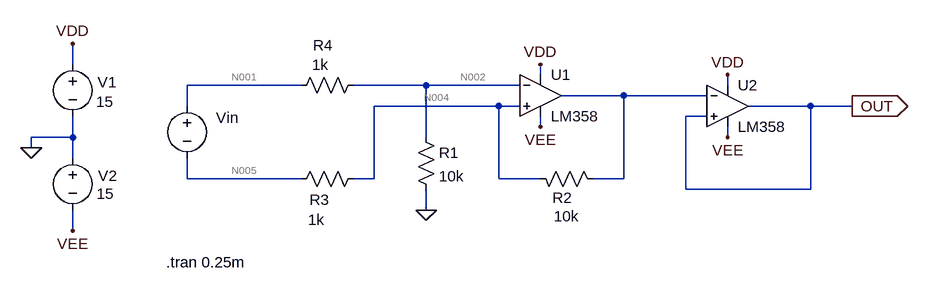
[diagram p0: schematic v1.0.asc]
* v1.0.asc
V1 VDD 0 15
Vin N001 N005 SINE(0V 1V 10KH)
R2 N003 N004 10k
V2 0 VEE 15
* U1: LM358 (symbol MyLib\OpAmp\LM358 not available, pins judged from their places): In+=N004 In-=N002 V+=VDD V-=VEE OUT=N003
R3 N004 N005 1k
R4 N002 N001 1k
R1 N002 0 10k
* U2: LM358 (symbol MyLib\OpAmp\LM358 not available, pins judged from their places): In+=OUT In-=N003 V+=VDD V-=VEE OUT=OUT
.tran 0.25m
.backanno
.end

* Results of the author's LTspice run, read from the files saved beside the schematic
* Operating Point, zero values left out:
*   V(n001) = 100 µV
*   V(n002) = 100 µV
*   V(n004) = 100 µV
*   V(n005) = 100 µV
*   V(vdd) = 15 V
*   V(vee) = -15 V
*   I(R1) = 10 nA
*   I(R2) = -10 nA
*   I(V1) = -688.2 µA
*   I(V2) = -688.2 µA
*   Ix(u1:1) = -10 nA
*   Ix(u1:2) = -10 nA
*   Ix(u1:3) = 20 nA
*   Ix(u1:4) = 344.1 µA
*   Ix(u1:5) = -344.1 µA
*   Ix(u2:1) = -10 nA
*   Ix(u2:2) = -10 nA
*   Ix(u2:3) = 10 nA
*   Ix(u2:4) = 344.1 µA
*   Ix(u2:5) = -344.1 µA
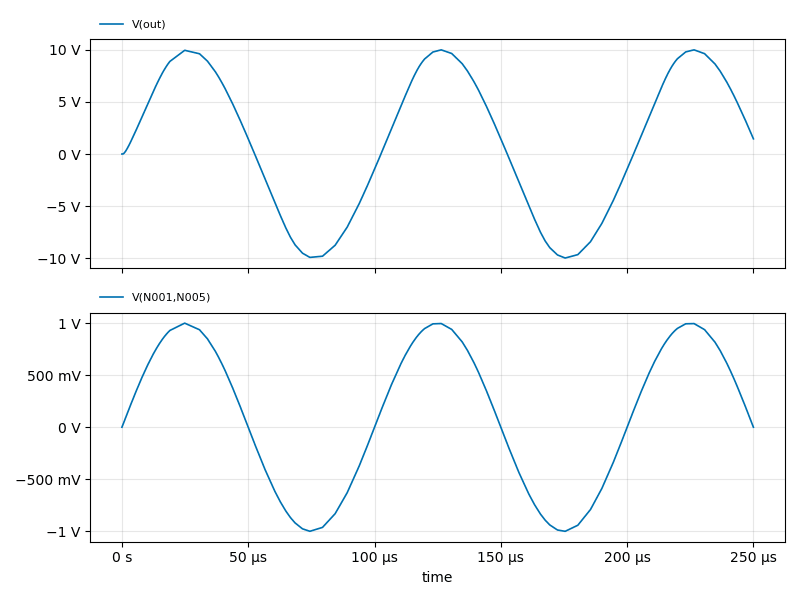
[diagram p1: Transient Analysis of v1.0.asc, plotted from the saved traces]
* Transient Analysis, 1 run:
*   V(out): min -9.963 V, max 9.978 V, average 1.262 V, rms 6.968 V, last 1.456 V
*   V(N001,N005): min -999.5 mV, max 999.8 mV, average 127.2 mV, rms 706.1 mV, last 0 V